# Altium project Altium_Example_PCB.PrjPcb
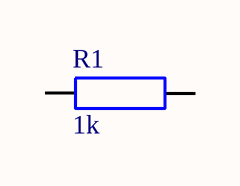
[diagram p0: Altium_Example_SCHDOC.SchDoc]
1 sheet, 1 parts. Net scope: global (net labels, ports and power ports of the same name join across sheets).
Board file: Altium_Example_PCBDOC.PcbDoc

## Sheet Altium_Example_SCHDOC.SchDoc
size A4; SheetNumber: 1; SheetTotal: 1

### Parts
R1  1k  [Resistencia]

### Nets

Not connected (* = marked no-connect by the designer): R1 1 2